# Altium schematic sheet gpio.SchDoc
size A4
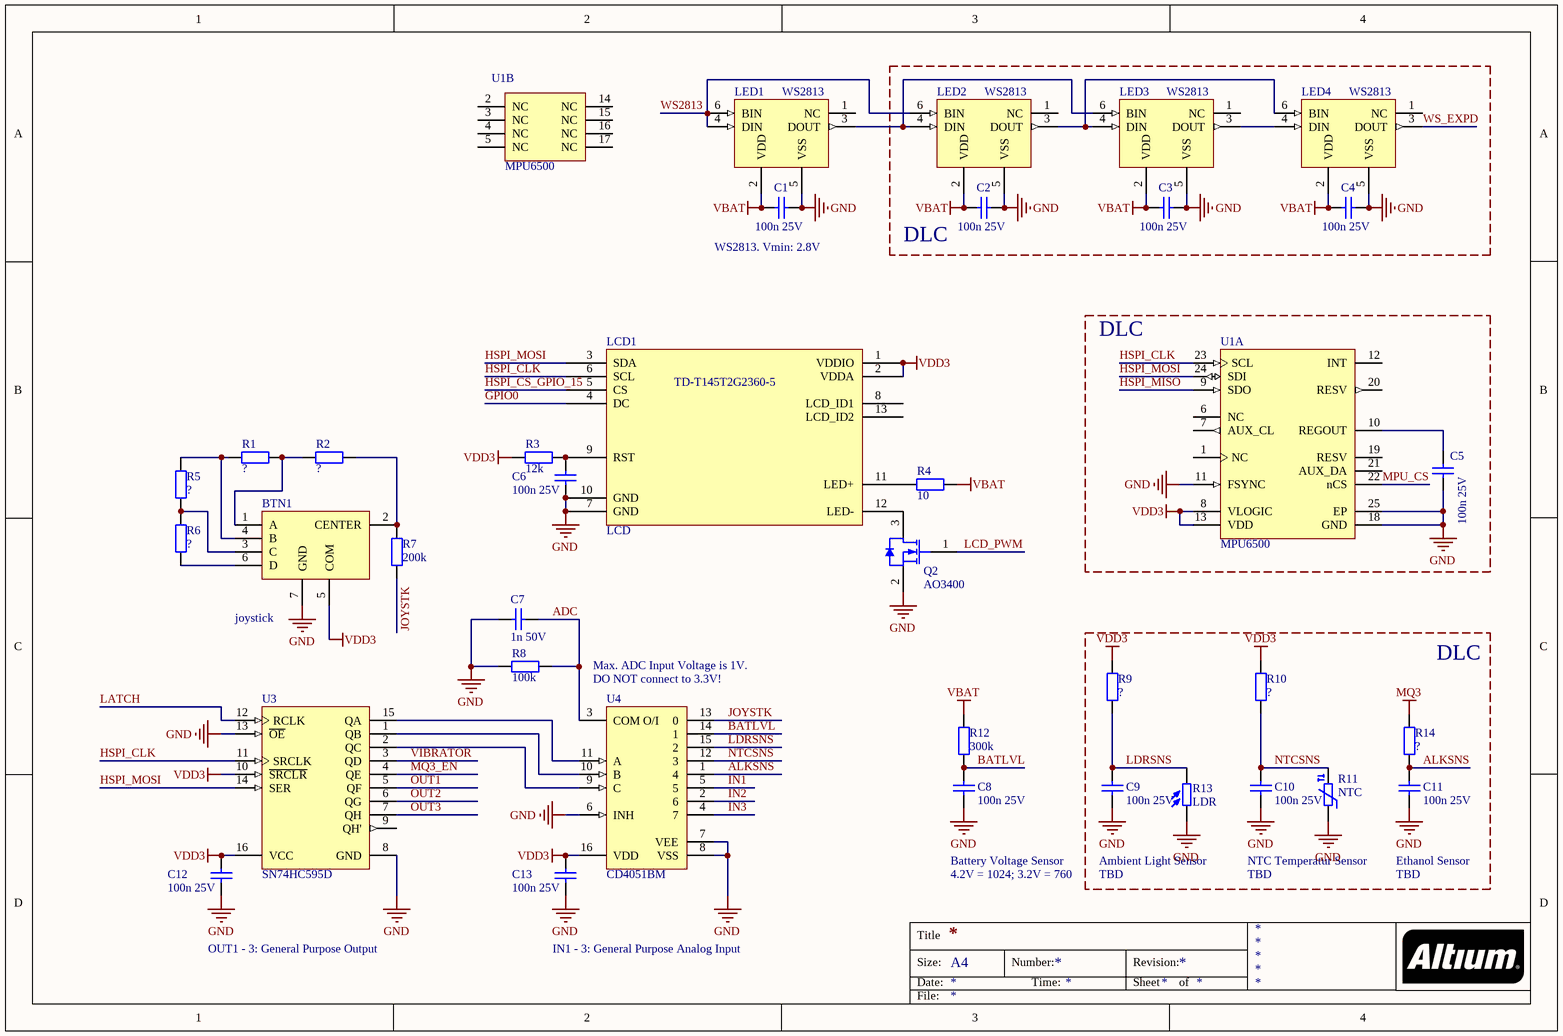
[diagram p0: gpio.SchDoc]

## Parts
(Parts that share a designator on the sheet are numbered #1, #2 ... from top to bottom, then left to right.)
BTN1  joystick  [joystick]
C1  100n 25V  [C-0603-M]
C2  100n 25V  [C-0603-M]
C3  100n 25V  [C-0603-M]
C4  100n 25V  [C-0603-M]
C5  100n 25V  [C-0603-M]
C6  100n 25V  [C-0603-M]
C7  1n 50V  [C-0603-M]
C8  100n 25V  [C-0603-M]
C9  100n 25V  [C-0603-M]
C10  100n 25V  [C-0603-M]
C11  100n 25V  [C-0603-M]
C12  100n 25V  [C-0603-M]
C13  100n 25V  [C-0603-M]
LCD1  LCD  [LCD]
LED1  WS2813  [plcc6]
LED2  WS2813  [plcc6]
LED3  WS2813  [plcc6]
LED4  WS2813  [plcc6]
Q2  AO3400  [AO-SOT23-3_V]
R1  ?  [R-0603-M]
R2  ?  [R-0603-M]
R3  12k  [R-0603-M]
R4  10  [R-0603-M]
R5  ?  [R-0603-M]
R6  ?  [R-0603-M]
R7  200k  [R-0603-H]
R8  100k  [R-0603-M]
R9  ?  [R-0603-M]
R10  ?  [R-0603-M]
R11  NTC  [NTC]
R12  300k  [R-0603-M]
R13  LDR  [LDR-5mm]
R14  ?  [R-0603-M]
U1#1  MPU6500  [INSE-QFN-24_V]  (part B of 2)
U1#2  MPU6500  [INSE-QFN-24_V]  (part A of 2)
U3  SN74HC595D  [D0016A_L]
U4  CD4051BM  [D0016A_M]

## Blocks framed on the sheet
DLC: C2-C4 LED2-LED4
DLC: C5 U1#2
DLC: C9-C11 R9-R11 R13 R14

## Nets
GND: BTN1.7(GND) C1.1 C2.1 C3.1 C4.1 C5.1 C6.1 C7.1 C8.1 C9.1 C10.1 C11.1 C12.1 C13.1 LCD1.7(GND) LCD1.10(GND) LED1.5(VSS) LED2.5(VSS) LED3.5(VSS) LED4.5(VSS) Q2.2(S) R8.1 R11.1 R13.1 U1#2.11(FSYNC) U1#2.18(GND) U1#2.25(EP) U3.8(GND) U3.13(~{OE}) U4.6(INH) U4.7(VEE) U4.8(VSS)
MQ3: R14.2
VBAT: C1.2 C2.2 C3.2 C4.2 LED1.2(VDD) LED2.2(VDD) LED3.2(VDD) LED4.2(VDD) R4.2 R12.2
VDD3: BTN1.5(COM) C12.2 C13.2 LCD1.1(VDDIO) LCD1.2(VDDA) R3.1 R9.2 R10.2 U1#2.8(VLOGIC) U1#2.13(VDD) U3.10(~{SRCLR}) U3.16(VCC) U4.16(VDD)
ADC: C7.2 R8.2 U4.3(COM_O/I)
ALKSNS: C11.2 R14.1 U4.1(4)
BATLVL: C8.2 R12.1 U4.14(1)
GPIO0: LCD1.4(DC)
HSPI_CLK: LCD1.6(SCL) U1#2.23(SCL) U3.11(SRCLK)
HSPI_CS_GPIO_15: LCD1.5(CS)
HSPI_MISO: U1#2.9(SDO)
HSPI_MOSI: LCD1.3(SDA) U1#2.24(SDI) U3.14(SER)
IN1: U4.5
IN2: U4.2(6)
IN3: U4.4(7)
JOYSTK: R7.1 U4.13(0)
LATCH: U3.12(RCLK)
LCD_PWM: Q2.1(G)
LDRSNS: C9.2 R9.1 R13.2 U4.15(2)
MPU_CS: U1#2.22(nCS)
MQ3_EN: U3.4(QE)
NTCSNS: C10.2 R10.1 R11.2 U4.12(3)
OUT1: U3.5(QF)
OUT2: U3.6(QG)
OUT3: U3.7(QH)
VIBRATOR: U3.3(QD)
WS2813: LED1.4(DIN) LED1.6(BIN) LED2.6(BIN)
WS_EXPD: LED4.3(DOUT)
NetBTN1_1: BTN1.1(A) R1.2 R2.1
NetBTN1_2: BTN1.2(CENTER) R2.2 R7.2
NetBTN1_3: BTN1.3(C) R5.2 R6.2
NetBTN1_4: BTN1.4(B) R1.1 R5.1
NetBTN1_6: BTN1.6(D) R6.1
NetC5_2: C5.2 U1#2.10(REGOUT)
NetC6_2: C6.2 LCD1.9(RST) R3.2
NetLCD1_11: LCD1.11(LED+) R4.1
NetLCD1_12: LCD1.12(LED-) Q2.3(D)
NetLED1_3: LED1.3(DOUT) LED2.4(DIN) LED3.6(BIN)
NetLED2_3: LED2.3(DOUT) LED3.4(DIN) LED4.6(BIN)
NetLED3_3: LED3.3(DOUT) LED4.4(DIN)
NetU3_1: U3.1(QB) U4.10(B)
NetU3_2: U3.2(QC) U4.9(C)
NetU3_15: U3.15(QA) U4.11(A)

Not connected (* = marked no-connect by the designer): LCD1 8(LCD_ID1) 13(LCD_ID2); LED1 1(NC); LED2 1(NC); LED3 1(NC); LED4 1(NC); U1#1 2(NC) 3(NC) 4(NC) 5(NC) 14(NC) 15(NC) 16(NC) 17(NC); U1#2 1(NC) 6(NC) 7(AUX_CL) 12(INT) 19(RESV) 20(RESV) 21(AUX_DA); U3 9(QH')

## Notes on the sheet
- (near C1) WS2813. Vmin: 2.8V
- Max. ADC Input Voltage is 1V.
- DO NOT connect to 3.3V!
- Battery Voltage Sensor
- 4.2V = 1024; 3.2V = 760
- Ambient Light Sensor
- TBD
- NTC Temperatur Sensor
- Ethanol Sensor
- OUT1 - 3: General Purpose Output
- IN1 - 3: General Purpose Analog Input
- Title
- Size:
- Date:
- A4
- Number:
- Time:
- Revision:
- Sheet
- of
- File:
- (in symbol LCD) TD-T145T2G2360-5

## Library data of the parts
C1-C6 C8-C13 = C-0603-100n-25V: Capacitor 100n 25V; Supplier 1: Mouser; Supplier Part Number 1: 80-C0603C104K3R
C7 = C-0603-1n-50V: Capacitor 1nF 50V; Supplier 1: Mouser; Supplier Part Number 1: 80-C0603C102J5G
LED1-LED4 = WS2813: WS2813 Addressable LED
Q2 = CMP-0278-00001-1: N-channel Enhancement Mode Field-Effect Transistor; 5.8A/30V; Manufacturer: Alpha and Omega; Channel Type: N; Drain-Source Voltage Limit: 30 V; Junction Temperature: -55 to 150 degC; Gate-Source Voltage Limit: +/-12 V; PackageDescription: 3-Pin SOT23, 3.016 x 2.8 mm Body, 0.95 mm Pitch; ComponentLink2Description: Datasheet; DatasheetVersion: Rev.8, 12/2011; ComponentLink3URL: http://www.aosmd.com/res/packaging_information/SOT-23.pdf; Storage Temperature: -55 to 150 degC; ComponentLink3Description: Package Specification; PackageReference: SOT23; ComponentLink1Description: Manufacturer URL; Mounting Technology: Surface Mount; ComponentLink1URL: http://www.aosmd.com/; PartNumber: AO3400; ComponentLink2URL: http://www.aosmd.com/res/data_sheets/AO3400.pdf
R1 R2 R5 R6 = R-0603-0: Resistor 0; Resistance: 0; Supplier 1: Mouser; Supplier Part Number 1: 71-CRCW0603-0-E3
R3 = R-0603-12k: Resistor 12k; Supplier 1: Mouser; Supplier Part Number 1: 71-CRCW0603-12K-E3
R4 = R-0603-10: Resistor 10; Supplier 1: Mouser; Supplier Part Number 1: 71-CRCW0603-10-E3
R7 = R-0603-200k: Resistor 200k; Supplier 1: Mouser; Supplier Part Number 1: 71-CRCW0603-200K-E3
R8 = R-0603-100k: Resistor 100k; Supplier 1: Mouser; Supplier Part Number 1: 71-CRCW0603-100K-E3
R9 R10 R12 R14 = R-0603-300k: Resistor 300k; Resistance: 300k; Supplier 1: Mouser; Supplier Part Number 1: 71-CRCW0201300KFKED
U1#1 U1#2 = CMP-1753-00002-1: 3-Axis Gyroscope, 3-Axis Accelerometer / , 2.375 to 3.46 V, -40 to 105 degC, 24-Pin QFN, RoHS, Tape and Reel; Resistance: 5.6 kohm; Tolerance: 1%; Voltage Rating: 75 V; Power Rating: 100 mW; ComponentLink1Description: Manufacturer URL; Mount: Surface Mount; Max Operating Temperature: 155degC; Package Quantity: 5000; ComponentLink2Description: Datasheet; Pins: 2; Packaging: Tape and Reel; Case Code (Imperial): 0603; PackageReference: QFN-24; ComponentLink2URL: https://datasheet.ciiva.com/1513/1788002-1513632.pdf; Radiation Hardening: No; ComponentLink1URL: http://www.invensense.com/; PackageDescription: 24-Pin Quad Flat No-lead Package, Body 4 x 4 mm, Pitch 0.5 mm; Height: 0.45 mm; Case/Package: 0603; Case Code (Metric): 1608; REACH SVHC: Yes; Min Operating Temperature: -55degC; DatasheetVersion: Rev. 3.4, 08/2013; Width: 0.8 mm; RoHSCompliant: True; Length: 1.6 mm; PartId: 1
U3 = CMP-0780-00038-3: 8-Bit Shift Registers With 3-State Output Registers, D0016A, TUBE; Manufacturer: Texas Instruments; Bits: 8; F @ Nom Voltage(Max)(Mhz): 28; Voltage(Nom)(V): 6; ICC @ Nom Voltage(Max)(mA): 0.08; Output Drive (IOL/IOH)(Max)(mA): 7.8/-7.8; tpd @ Nom Voltage(Max)(ns): 34; 3-State Output: Yes; VCC(Min)(V): 2; Output Type: CMOS; Technology Family: HC; Rating: Military; Generic Part Number: SN74HC595; PackageReference: D0016A; Code_JEDEC: MS-012 variation AC; Operating Temperature Range(C): -40 to 85; VCC(Max)(V): 6; DatasheetVersion: SCLS041H; Input Type: CMOS; PackageVersion: http://www.ti.com/lit/ml/mpds178g/mpds178g.pdf
U4 = CMP-1575-00043-4: CMOS Single 8-Channel Analog Multiplexer/Demultiplexer with Logic-Level Conversion, D0016A, TUBE; Manufacturer: Texas Instruments; Ron(Typ)(Ohms): 125; Configuration: 1 X 1：8 MUX; ICC(Typ)(mA): 0.00008; Ron(Max)(Ohms): 240; VCC(Min)(V): 5; VCC(Max)(V): 18; Crosstalk: Yes; Bandwidth(Max)(MHz): 20; Rating: Military; Output Drive (IOL/IOH)(Max)(mA): 1; DatasheetVersion: SCHS047G; Generic Part Number: CD4051B; Output Type: CMOS; PackageReference: D0016A; PackageVersion: http://www.ti.com/lit/ml/mpds178g/mpds178g.pdf; Operating Temperature Range(C): -55 to 125; Code_JEDEC: MS-012 variation AC